# EAGLE design DualPowerSupply (EAGLE 9.6.2)
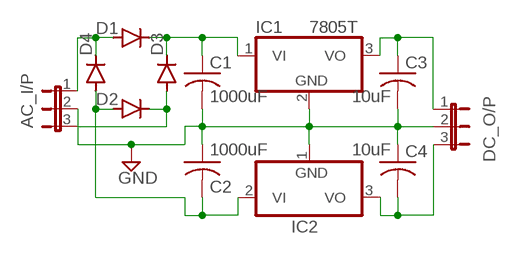
[diagram p0: schematic, sheet 1]

## Parts
AC_I/P  JP2E  [JP2]
C1  1000uF  C-US025_050-025X075  [C025_050-025X075]
C2  1000uF  C-US025_050-025X075  [C025_050-025X075]
C3  10uF  C-US025_050-025X075  [C025_050-025X075]
C4  10uF  C-US025_050-025X075  [C025_050-025X075]
D1  1N4004  [DO41-10]
D2  1N4004  [DO41-10]
D3  1N4004  [DO41-10]
D4  1N4004  [DO41-10]
DC_O/P  JP2E  [JP2]
IC1  7805T  [TO220H]
IC2  7905T  [TO220H]

## Nets
GND: AC_I/P.2 C1.2 C2.1 C3.2 C4.1 DC_O/P.2 IC1.2(GND) IC2.1(GND)
N$2: C2.2 D2.A D4.A IC2.2(VI)
N$3: AC_I/P.3 D2.C D3.A
N$4: C1.1 D1.C D3.C IC1.1(VI)
N$5: AC_I/P.1 D1.A D4.C
N$6: C3.1 DC_O/P.1 IC1.3(VO)
N$7: C4.2 DC_O/P.3 IC2.3(VO)

## Library data of the parts
AC_I/P DC_O/P = jumper:JP2E: JUMPER
C1-C4 = adafruit:C-US: CAPACITOR, American symbol
D1-D4 = diode:1N4004: DIODE general purpose rectifier, 1 A
IC1 = linear:78*: Positive VOLTAGE REGULATOR Source: http://cache.national.com/ds/LM/LM78L05.pdf http://www.fairchildsemi.com/ds/LM/LM7805.pdf
IC2 = linear:79*: Negative VOLTAGE REGULATOR

## Board
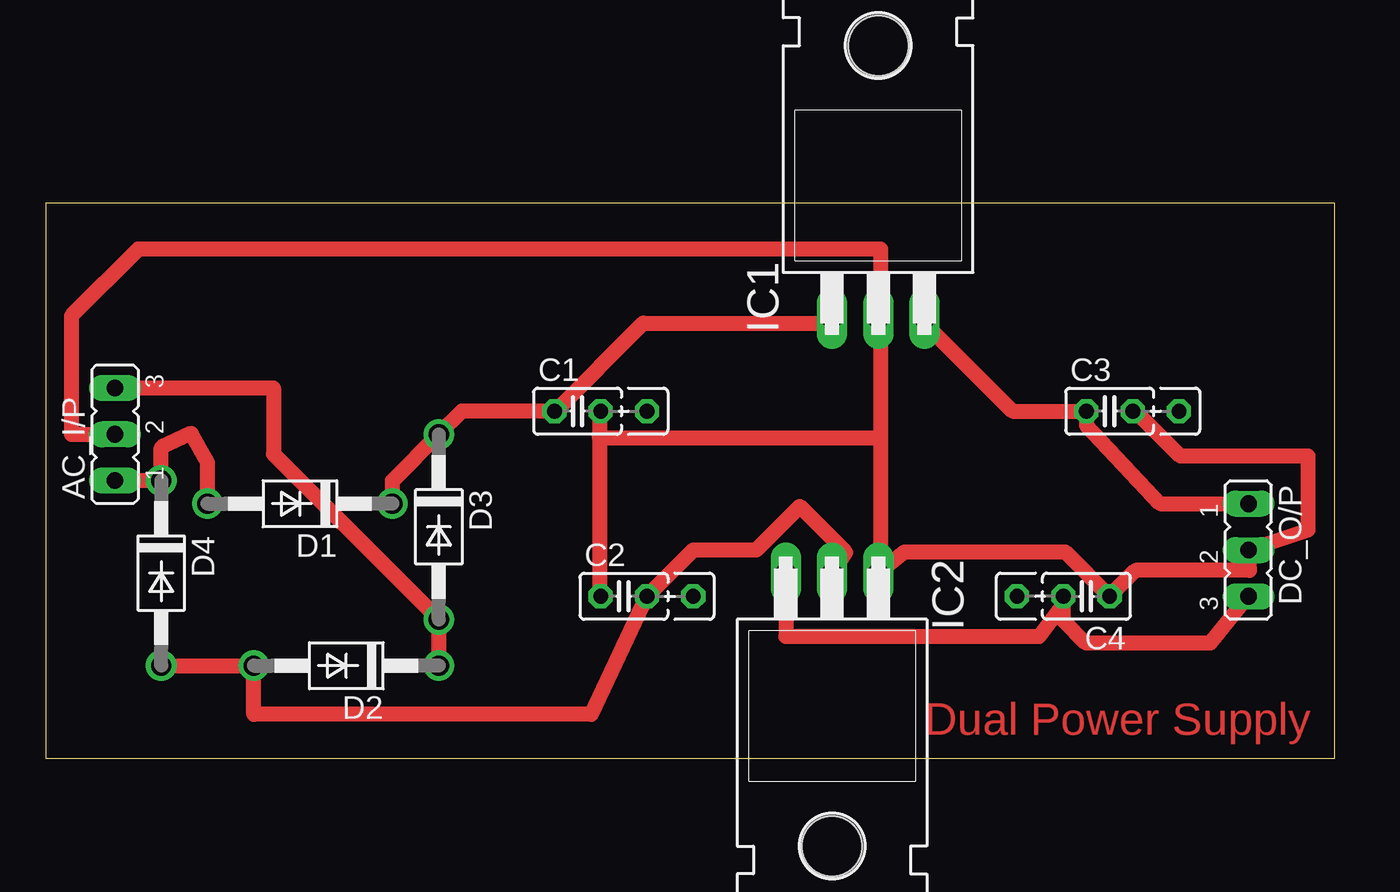
[diagram p1: board, top side]

Size 70.79 x 30.47 mm. Coordinates in mm from the lower left corner, seen from the top.
Outline: 0,0 70.79,0 70.79,30.47 0,30.47 0,0
Copper layers (1*16): Top 0.035mm / dielectric 1.5mm / Bottom 0.035mm
Design rules "default *": minimum track width 32mil, minimum drill 0.35mm, track to track 6mil, track to pad 6mil, pad to pad 6mil, via to via 6mil, smd to smd 6mil, copper to edge 40mil, drill to drill 6mil, minimum pad ring 10mil, minimum via ring 8mil, stop-mask expansion 4mil, vias tented up to drill 0mil, thermal gap 10mil

### Footprints (pad centres in the part's own frame; a part is rotated, then mirrored left to right if it is on the bottom)
JP2 = drill 0.914 long: 1 -2.54,0; 2 0,0; 3 2.54,0
C025_050-025X075 = drill 0.813 octagon: 1 -1.27,0; 2 1.27,0; 3 3.81,0
DO41-10 = drill 1.118: A 5.08,0; C -5.08,0
TO220H = drill 1.118 long: 1 -2.54,-10.16; 2 0,-10.16; 3 2.54,-10.16 | hole 3.302: 0,4.826

### Placement (x,y rotation side)
AC_I/P  3.81,17.78 90 top
C1  29.21,19.05 0 top
C2  31.75,8.89 0 top
C3  58.42,19.05 0 top
C4  57.15,8.89 180 top
D1  13.97,13.97 180 top
D2  16.51,5.08 180 top
D3  21.59,12.7 270 top
D4  6.35,10.16 270 top
DC_O/P  66.04,11.43 270 top
IC1  45.72,34.29 0 top
IC2  43.18,0 180 top

### Tracks (layer width: path | path; a pad name or v marks a point on that pad's centre or on a via)
GND
  Top 0.813: C3.2 59.84,19.05 62.31,16.59 69.32,16.59 69.32,12.52 DC_O/P.2 66.11,10.31 59.84,10.31 C4.1 55.98,11.33 47.18,11.33 IC2.1 45.85,10.54 45.85,17.6 | 45.85,17.6 45.85,23.88 IC1.2 45.85,24.26 45.85,27.94 5.08,27.94 1.42,24.28 1.42,17.78 AC_I/P.2 | 30.4,17.6 30.4,19.05 C1.2 | 30.4,17.6 30.4,8.94 C2.1 | 30.4,17.6 45.85,17.6
N$2
  Top 0.813: D4.A 6.63,5.05 10.97,5.05 D2.A 11.43,2.41 29.97,2.41 C2.2 35.56,11.43 39.01,11.43 41.41,13.83 43.94,11.3 IC2.2
N$3
  Top 0.813: AC_I/P.3 12.52,20.32 12.52,16.69 D3.A D2.C
N$4
  Top 0.813: D1.C 19.05,15.24 D3.C 22.86,19.05 C1.1 27.99,19.05 32.82,23.88 42.95,23.88 IC1.1
N$5
  Top 0.813: AC_I/P.1 D4.C 6.35,17.06 8,17.84 8.89,16.24 D1.A
N$6
  Top 0.813: IC1.3 48.26,23.88 53.09,19.05 C3.1 57.15,18.28 60.41,14.8 61.19,13.97 DC_O/P.1
N$7
  Top 0.813: DC_O/P.3 63.96,6.32 57.12,6.32 55.88,7.57 C4.2 55.88,8.46 54.55,6.68 40.64,6.68 IC2.3

### Text on the board
Top: Dual Power Supply